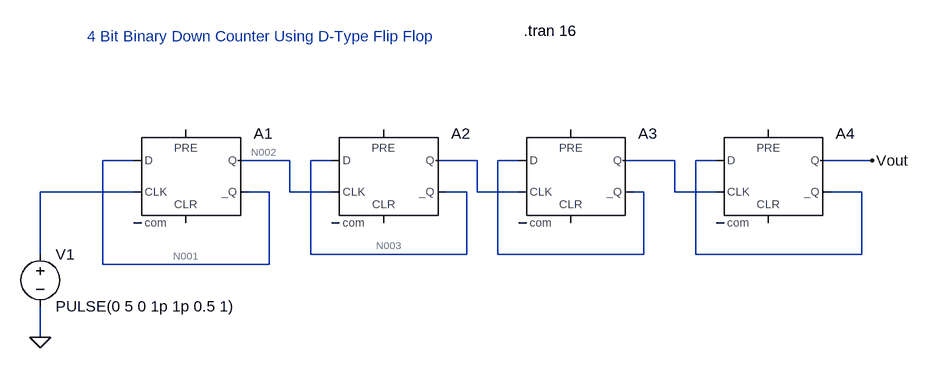
[diagram p0: schematic 4 Bit Binary Down Counter Using D-Type Flip Flop.asc]
4 Bit Binary Down Counter Using D-Type Flip Flop.asc, the LTspice schematic file:
Version 4
SHEET 1 936 680
WIRE -272 176 -320 176
WIRE -32 176 -112 176
WIRE 32 176 0 176
WIRE 256 176 192 176
WIRE 320 176 288 176
WIRE 560 176 480 176
WIRE 624 176 592 176
WIRE 864 176 784 176
WIRE -272 224 -416 224
WIRE -64 224 -96 224
WIRE -32 224 -32 176
WIRE 32 224 -32 224
WIRE 240 224 208 224
WIRE 256 224 256 176
WIRE 320 224 256 224
WIRE 512 224 496 224
WIRE 560 224 560 176
WIRE 624 224 560 224
WIRE 848 224 800 224
WIRE -416 320 -416 224
WIRE 0 320 0 176
WIRE 240 320 240 224
WIRE 240 320 0 320
WIRE 288 320 288 176
WIRE 512 320 512 224
WIRE 512 320 288 320
WIRE 592 320 592 176
WIRE 848 320 848 224
WIRE 848 320 592 320
WIRE -320 336 -320 176
WIRE -64 336 -64 224
WIRE -64 336 -320 336
WIRE -416 448 -416 400
FLAG -416 448 0
FLAG 864 176 Vout
SYMBOL Digital\\dflop -192 128 R0
SYMATTR InstName A1
SYMBOL Digital\\dflop 112 128 R0
SYMATTR InstName A2
SYMBOL Digital\\dflop 400 128 R0
SYMATTR InstName A3
SYMBOL Digital\\dflop 704 128 R0
SYMATTR InstName A4
SYMBOL voltage -416 304 R0
WINDOW 123 0 0 Left 0
WINDOW 39 0 0 Left 0
SYMATTR InstName V1
SYMATTR Value PULSE(0 5 0 1p 1p 0.5 1)
TEXT -344 -16 Left 2 ;4 Bit Binary Down Counter Using D-Type Flip Flop
TEXT 328 -24 Left 2 !.tran 16

The netlist it stands for:
* 4 Bit Binary Down Counter Using D-Type Flip Flop.asc
A1 N001 0 N008 0 0 N001 N002 0 DFLOP
A2 N003 0 N002 0 0 N003 N004 0 DFLOP
A3 N005 0 N004 0 0 N005 N006 0 DFLOP
A4 N007 0 N006 0 0 N007 Vout 0 DFLOP
V1 N008 0 PULSE(0 5 0 1p 1p 0.5 1)
* 4 Bit Binary Down Counter Using D-Type Flip Flop
.tran 16
.backanno
.end

* Results of the author's LTspice run, read from the files saved beside the schematic
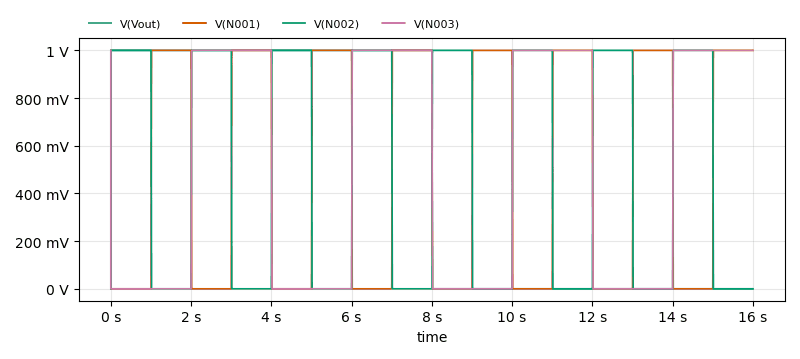
[diagram p1: Transient Analysis of 4 Bit Binary Down Counter Using D-Type Flip Flop.asc, plotted from the saved traces]
* Transient Analysis, 1 run:
*   V(Vout): min 0 V, max 1 V, average 500.5 mV, rms 707.5 mV, last 0 V
*   V(N001): min 0 V, max 1 V, average 499.5 mV, rms 706.8 mV, last 1 V
*   V(N002): min 0 V, max 1 V, average 500.5 mV, rms 707.5 mV, last 0 V
*   V(N003): min 0 V, max 1 V, average 499.5 mV, rms 706.8 mV, last 1 V